# Altium schematic sheet Final out 1.SchDoc
size A4; SheetNumber: 5; SheetTotal: 5
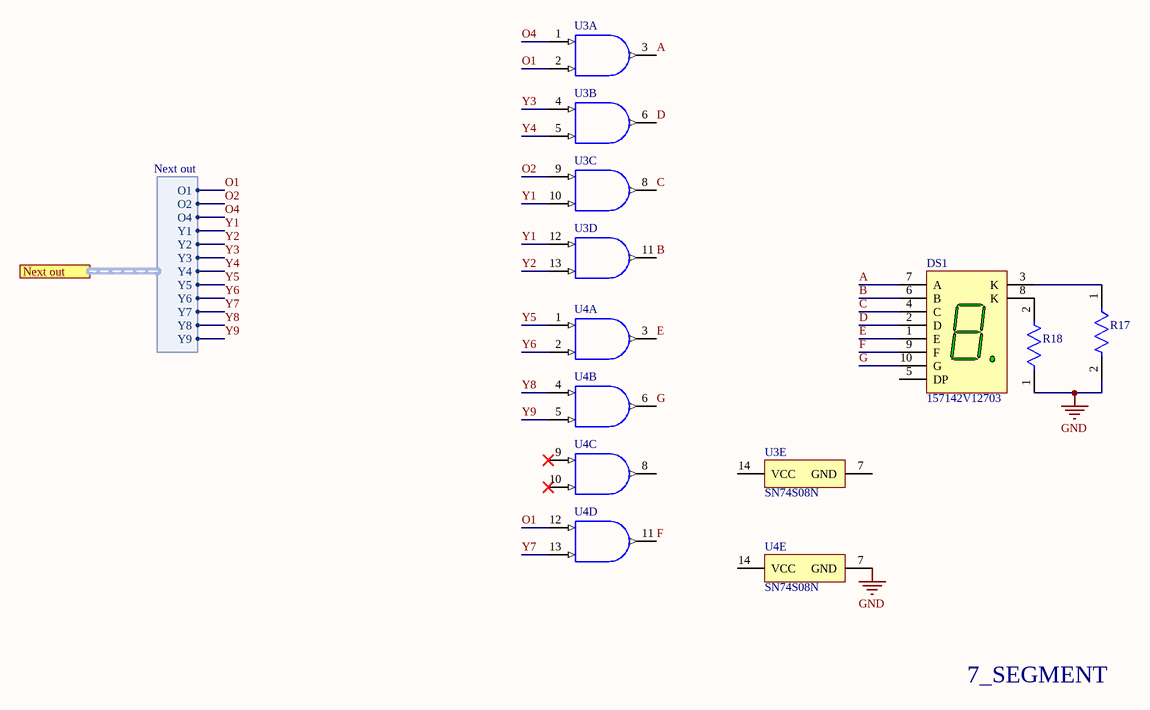
[diagram p0: Final out 1.SchDoc]

## Parts
DS1  157142V12703  [WL-T7DS_L19W12.6H7.9]
R17  MRS25000C1001FCT00  [FP-MRS25-MFG]  (value not drawn)
R18  MRS25000C1001FCT00  [FP-MRS25-MFG]  (value not drawn)
U3  SN74S08N  [N0014A]  (value not drawn)  (parts A,B,C,D,E of 5)
U4  SN74S08N  [N0014A]  (value not drawn)  (parts A,B,C,D,E of 5)

## Ports
Next out (harness Next out, see Top[3C], AND operations 1[4B])

## Harnesses
Next out: O1, O2, O4, Y1, Y2, Y3, Y4, Y5, Y6, Y7, Y8, Y9

## Nets
GND: R17.2 R18.1 U4.7(GND)
A: DS1.7(A) U3.3(1Y)
B: DS1.6(B) U3.11(4Y)
C: DS1.4(C) U3.8(3Y)
D: DS1.2(D) U3.6(2Y)
E: DS1.1(E) U4.3(1Y)
F: DS1.9(F) U4.11(4Y)
G: DS1.10(G) U4.6(2Y)
O1: U3.2(1B) U4.12(4A) ; port Next out.O1
O2: U3.9(3A) ; port Next out.O2
O4: U3.1(1A) ; port Next out.O4
Y1: U3.10(3B) U3.12(4A) ; port Next out.Y1
Y2: U3.13(4B) ; port Next out.Y2
Y3: U3.4(2A) ; port Next out.Y3
Y4: U3.5(2B) ; port Next out.Y4
Y5: U4.1(1A) ; port Next out.Y5
Y6: U4.2(1B) ; port Next out.Y6
Y7: U4.13(4B) ; port Next out.Y7
Y8: U4.4(2A) ; port Next out.Y8
Y9: U4.5(2B) ; port Next out.Y9
NetDS1_3: DS1.3(K) R17.1
NetDS1_8: DS1.8(K) R18.2

Not connected (* = marked no-connect by the designer): DS1 5(DP); U3 7(GND) 14(VCC); U4 8(3Y) 9(3A)* 10(3B)* 14(VCC)

## Notes on the sheet
- 7_SEGMENT

## Library data of the parts
DS1 = CMP-03913-119894004-1: 157142V12703 7-Seg Display, Comm Cathode, Grn, 46Mcd Rohs Compliant: Yes; Forward Current: 100mA; Luminous Intensity: 25mcd; Forward Voltage: 2.2V; Max Reverse Voltage (DC): 5V; Dominant Wavelength: 572nm; NexarPartId: 119894004; Width: 12.6mm; Height: 8mm; RoHS: Compliant; Length: 19mm; Min Operating Temperature: -40°C; Max Operating Temperature: 85°C
R17 R18 = CMP-02408-000051-1: RES 1K OHM 0.6W 1% AXIAL; Power Rating: 600mW; Lead Diameter: 0.6mm; Voltage Rating (DC): 350V; Resistance: 1kR; Temperature Coefficient: 50ppm/°C; Width: 2.5mm; Military Standard: Not; Package Quantity: 5000; Radiation Hardening: No; Case/Package: Axial; Resistance Tolerance: 1%; Resistor Type: Metal Film; Contact Plating: Tin; Length: 6.5mm; Lead Free: Lead Free; RoHS Compliant: Yes; Mount: Through Hole; Number of Pins: 2; Technology: THIN FILM; Voltage Rating: 350V; Min Operating Temperature: -55°C; Weight: 0.00776oz; Diameter: 2.5mm; Construction: Cylindrical; Series: MRS25; Tolerance: 1%; Packaging: Tape and Reel; Max Operating Temperature: 155°C; Max Power Dissipation: 600mW; Number of Terminations: 2; Termination: Axial
U3 U4 = CMP-0777-00282-3: Quad 2-input positive-AND gates, N0014A, TUBE; Manufacturer: Texas Instruments; Output Drive (IOL/IOH)(Max)(mA): -24/24; Rating: Catalog; VCC(Min)(V): 4.75; Bits(#): 4; Input Type: TTL; Schmitt Trigger: No; tpd @ Nom Voltage(Max)(ns): 7.5; Technology Family: S; Voltage(Nom)(V): 5; VCC(Max)(V): 5.25; F @ Nom Voltage(Max)(Mhz): 50; ICC @ Nom Voltage(Max)(mA): 0.032; PackageReference: N0014A; DatasheetVersion: SDLS033; Operating Temperature Range(C): 0 to 70; Output Type: TTL; Generic Part Number: SN74S08